# Altium project Printing.PrjPcb (part 4 of 4)

## Sheet Printing5.SchDoc
size A2
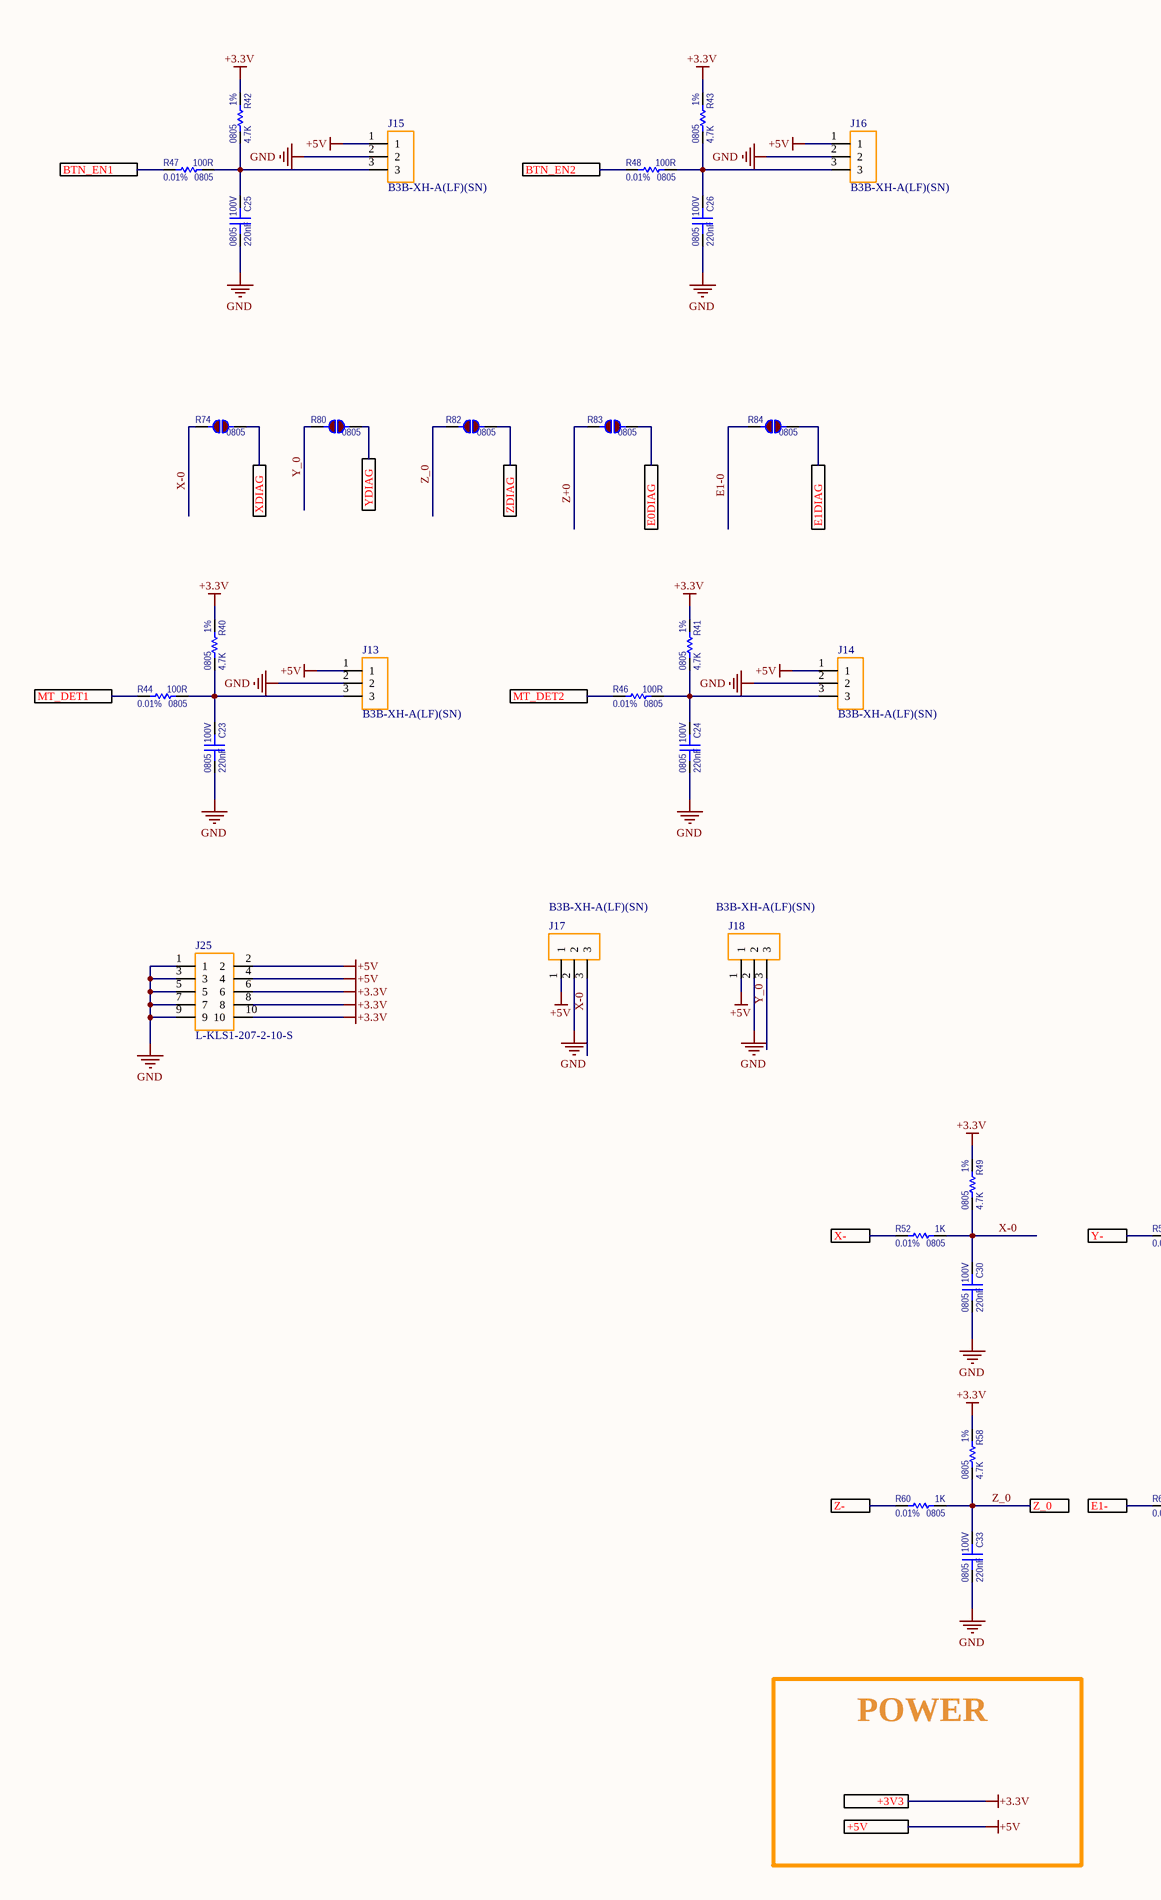
[diagram p7: Printing5.SchDoc, left]
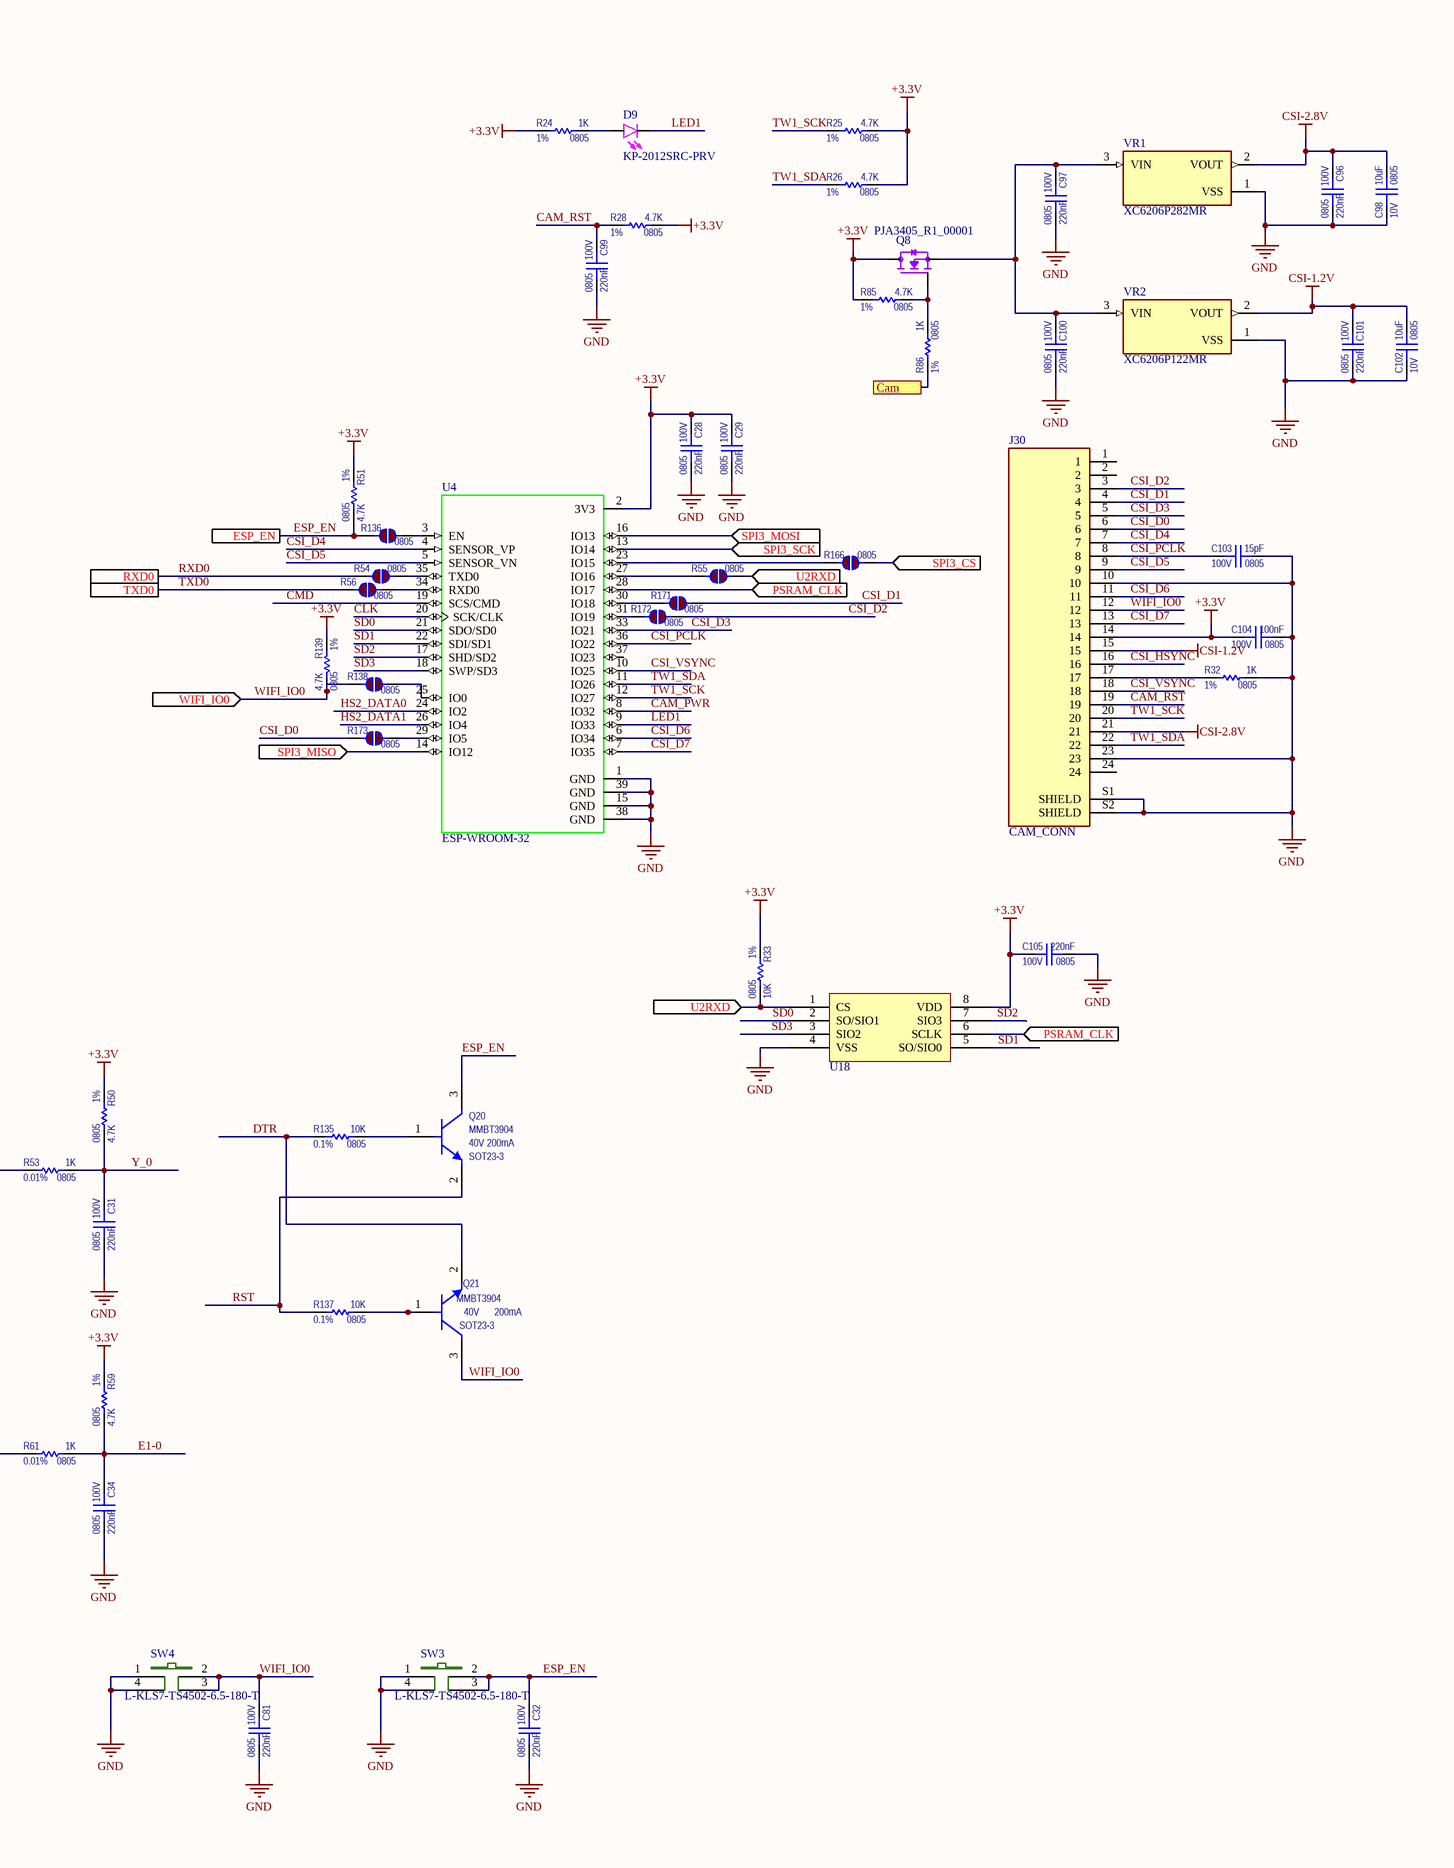
[diagram p8: Printing5.SchDoc, right]

### Parts
C23  value 220nF  Voltage: 100V  Package: 0805  [C_0805_GEN_1.40H]  (hidden comment: Capacitor)
C24  value 220nF  Voltage: 100V  Package: 0805  [C_0805_GEN_1.40H]  (hidden comment: Capacitor)
C25  value 220nF  Voltage: 100V  Package: 0805  [C_0805_GEN_1.40H]  (hidden comment: Capacitor)
C26  value 220nF  Voltage: 100V  Package: 0805  [C_0805_GEN_1.40H]  (hidden comment: Capacitor)
C28  value 220nF  Voltage: 100V  Package: 0805  [C_0805_GEN_1.40H]  (hidden comment: Capacitor)
C29  value 220nF  Voltage: 100V  Package: 0805  [C_0805_GEN_1.40H]  (hidden comment: Capacitor)
C30  value 220nF  Voltage: 100V  Package: 0805  [C_0805_GEN_1.40H]  (hidden comment: Capacitor)
C31  value 220nF  Voltage: 100V  Package: 0805  [C_0805_GEN_1.40H]  (hidden comment: Capacitor)
C32  value 220nF  Voltage: 100V  Package: 0805  [C_0805_GEN_1.40H]  (hidden comment: Capacitor)
C33  value 220nF  Voltage: 100V  Package: 0805  [C_0805_GEN_1.40H]  (hidden comment: Capacitor)
C34  value 220nF  Voltage: 100V  Package: 0805  [C_0805_GEN_1.40H]  (hidden comment: Capacitor)
C81  value 220nF  Voltage: 100V  Package: 0805  [C_0805_GEN_1.40H]  (hidden comment: Capacitor)
C96  value 220nF  Voltage: 100V  Package: 0805  [C_0805_GEN_1.40H]  (hidden comment: Capacitor)
C97  value 220nF  Voltage: 100V  Package: 0805  [C_0805_GEN_1.40H]  (hidden comment: Capacitor)
C98  value 10uF  Voltage: 10V  Package: 0805  [C_0805_GEN_1.40H]  (hidden comment: Capacitor)
C99  value 220nF  Voltage: 100V  Package: 0805  [C_0805_GEN_1.40H]  (hidden comment: Capacitor)
C100  value 220nF  Voltage: 100V  Package: 0805  [C_0805_GEN_1.40H]  (hidden comment: Capacitor)
C101  value 220nF  Voltage: 100V  Package: 0805  [C_0805_GEN_1.40H]  (hidden comment: Capacitor)
C102  value 10uF  Voltage: 10V  Package: 0805  [C_0805_GEN_1.40H]  (hidden comment: Capacitor)
C103  value 15pF  Voltage: 100V  Package: 0805  [C_0805_GEN_1.40H]  (hidden comment: Capacitor)
C104  value 100nF  Voltage: 100V  Package: 0805  [C_0805_GEN_1.40H]  (hidden comment: Capacitor)
C105  value 220nF  Voltage: 100V  Package: 0805  [C_0805_GEN_1.40H]  (hidden comment: Capacitor)
D9  KP-2012SRC-PRV  [0805 LED]
J13  B3B-XH-A(LF)(SN)  [JST_B3B-XH-A(LF)(SN)]
J14  B3B-XH-A(LF)(SN)  [JST_B3B-XH-A(LF)(SN)]
J15  B3B-XH-A(LF)(SN)  [JST_B3B-XH-A(LF)(SN)]
J16  B3B-XH-A(LF)(SN)  [JST_B3B-XH-A(LF)(SN)]
J17  B3B-XH-A(LF)(SN)  [JST_B3B-XH-A(LF)(SN)]
J18  B3B-XH-A(LF)(SN)  [JST_B3B-XH-A(LF)(SN)]
J25  L-KLS1-207-2-10-S  [L-KLS1-207-2-10-S]
J30  CAM_CONN  [CAM_CONN]
Q8  PJA3405_R1_00001  [PJA3405_R1_00001]
Q20  value MMBT3904  Current: 200mA  Voltage: 40V  Package: SOT23-3  [SOT23-3_MMBT3904,215]  (hidden comment: SingleNPN_B1E2C3)
Q21  value MMBT3904  Current: 200mA  Voltage: 40V  Package: SOT23-3  [SOT23-3_MMBT3904,215]  (hidden comment: SingleNPN_B1E2C3)
R24  value 1K  Tolerance: 1%  Package: 0805  [R_0805_GEN_0.60H]  (hidden comment: StandardResistor)
R25  value 4.7K  Tolerance: 1%  Package: 0805  [R_0805_GEN_0.60H]  (hidden comment: StandardResistor)
R26  value 4.7K  Tolerance: 1%  Package: 0805  [R_0805_GEN_0.60H]  (hidden comment: StandardResistor)
R28  value 4.7K  Tolerance: 1%  Package: 0805  [R_0805_GEN_0.60H]  (hidden comment: StandardResistor)
R32  value 1K  Tolerance: 1%  Package: 0805  [R_0805_GEN_0.60H]  (hidden comment: StandardResistor)
R33  value 10K  Tolerance: 1%  Package: 0805  [R_0805_GEN_0.60H]  (hidden comment: StandardResistor)
R40  value 4.7K  Tolerance: 1%  Package: 0805  [R_0805_GEN_0.60H]  (hidden comment: StandardResistor)
R41  value 4.7K  Tolerance: 1%  Package: 0805  [R_0805_GEN_0.60H]  (hidden comment: StandardResistor)
R42  value 4.7K  Tolerance: 1%  Package: 0805  [R_0805_GEN_0.60H]  (hidden comment: StandardResistor)
R43  value 4.7K  Tolerance: 1%  Package: 0805  [R_0805_GEN_0.60H]  (hidden comment: StandardResistor)
R44  value 100R  Tolerance: 0.01%  Package: 0805  [R_0805_GEN_0.70H]  (hidden comment: StandardResistor)
R46  value 100R  Tolerance: 0.01%  Package: 0805  [R_0805_GEN_0.70H]  (hidden comment: StandardResistor)
R47  value 100R  Tolerance: 0.01%  Package: 0805  [R_0805_GEN_0.70H]  (hidden comment: StandardResistor)
R48  value 100R  Tolerance: 0.01%  Package: 0805  [R_0805_GEN_0.70H]  (hidden comment: StandardResistor)
R49  value 4.7K  Tolerance: 1%  Package: 0805  [R_0805_GEN_0.60H]  (hidden comment: StandardResistor)
R50  value 4.7K  Tolerance: 1%  Package: 0805  [R_0805_GEN_0.60H]  (hidden comment: StandardResistor)
R51  value 4.7K  Tolerance: 1%  Package: 0805  [R_0805_GEN_0.60H]  (hidden comment: StandardResistor)
R52  value 1K  Tolerance: 0.01%  Package: 0805  [R_0805_GEN_0.70H]  (hidden comment: StandardResistor)
R53  value 1K  Tolerance: 0.01%  Package: 0805  [R_0805_GEN_0.70H]  (hidden comment: StandardResistor)
R54  Package: 0805  [R_0805_GEN_0.70H]  (hidden comment: StandardJumper)
R55  Package: 0805  [R_0805_GEN_0.70H]  (hidden comment: StandardJumper)
R56  Package: 0805  [R_0805_GEN_0.70H]  (hidden comment: StandardJumper)
R58  value 4.7K  Tolerance: 1%  Package: 0805  [R_0805_GEN_0.60H]  (hidden comment: StandardResistor)
R59  value 4.7K  Tolerance: 1%  Package: 0805  [R_0805_GEN_0.60H]  (hidden comment: StandardResistor)
R60  value 1K  Tolerance: 0.01%  Package: 0805  [R_0805_GEN_0.70H]  (hidden comment: StandardResistor)
R61  value 1K  Tolerance: 0.01%  Package: 0805  [R_0805_GEN_0.70H]  (hidden comment: StandardResistor)
R74  Package: 0805  [R_0805_GEN_0.70H]  (hidden comment: StandardJumper)
R80  Package: 0805  [R_0805_GEN_0.70H]  (hidden comment: StandardJumper)
R82  Package: 0805  [R_0805_GEN_0.70H]  (hidden comment: StandardJumper)
R83  Package: 0805  [R_0805_GEN_0.70H]  (hidden comment: StandardJumper)
R84  Package: 0805  [R_0805_GEN_0.70H]  (hidden comment: StandardJumper)
R85  value 4.7K  Tolerance: 1%  Package: 0805  [R_0805_GEN_0.60H]  (hidden comment: StandardResistor)
R86  value 1K  Tolerance: 1%  Package: 0805  [R_0805_GEN_0.60H]  (hidden comment: StandardResistor)
R135  value 10K  Tolerance: 0.1%  Package: 0805  [R_0805_GEN_0.70H]  (hidden comment: StandardResistor)
R136  Package: 0805  [R_0805_GEN_0.70H]  (hidden comment: StandardJumper)
R137  value 10K  Tolerance: 0.1%  Package: 0805  [R_0805_GEN_0.70H]  (hidden comment: StandardResistor)
R138  Package: 0805  [R_0805_GEN_0.70H]  (hidden comment: StandardJumper)
R139  value 4.7K  Tolerance: 1%  Package: 0805  [R_0805_GEN_0.60H]  (hidden comment: StandardResistor)
R166  Package: 0805  [R_0805_GEN_0.70H]  (hidden comment: StandardJumper)
R171  Package: 0805  [R_0805_GEN_0.70H]  (hidden comment: StandardJumper)
R172  Package: 0805  [R_0805_GEN_0.70H]  (hidden comment: StandardJumper)
R173  Package: 0805  [R_0805_GEN_0.70H]  (hidden comment: StandardJumper)
SW3  L-KLS7-TS4502-6.5-180-T  [L-KLS7-TS4502-6.5-180-T]
SW4  L-KLS7-TS4502-6.5-180-T  [L-KLS7-TS4502-6.5-180-T]
U4  ESP-WROOM-32  [ESP_DUAL]
U18  PSRAM_ESP32  [SOP8]  (value not drawn)
VR1  XC6206P282MR  [SOT95P280X130-3N]
VR2  XC6206P122MR  [SOT95P280X130-3N]

### Ports
+3V3, +5V, BTN_EN1, BTN_EN2, Cam, E0DIAG, E1-, E1DIAG, ESP_EN, MT_DET1, MT_DET2, PSRAM_CLK (in), RXD0, SPI3_CS (in), SPI3_MISO (in), SPI3_MOSI (in), SPI3_SCK (in), TXD0, U2RXD (in), WIFI_IO0 (in), X-, XDIAG, Y-, YDIAG, Z-, Z_0, ZDIAG

### Nets
+3.3V: C28.1 C29.1 C104.1 C105.1 J25.6 J25.8 J25.10 J30.14 Q8.3(D) R24.1 R25.2 R26.2 R28.2 R33.1 R40.1 R41.1 R42.1 R43.1 R49.1 R50.1 R51.1 R58.1 R59.1 R85.1 R139.1 U4.2(3V3) U18.8(VDD) ; port +3V3  [project net +3V3]
+5V: J13.1 J14.1 J15.1 J16.1 J17.1 J18.1 J25.2 J25.4 ; port +5V
CSI-1.2V: C101.1 C102.2 J30.15 VR2.2(VOUT)
CSI-2.8V: C96.1 C98.2 J30.21 VR1.2(VOUT)
GND: C23.2 C24.2 C25.2 C26.2 C28.2 C29.2 C30.2 C31.2 C32.2 C33.2 C34.2 C81.2 C96.2 C97.2 C98.1 C99.2 C100.2 C101.2 C102.1 C103.2 C104.2 C105.2 J13.2 J14.2 J15.2 J16.2 J17.2 J18.2 J25.1 J25.3 J25.5 J25.7 J25.9 J30.10 J30.23 J30.S1(SHIELD) J30.S2(SHIELD) R32.2 SW3.1(A0) SW3.4(A1) SW4.1(A0) SW4.4(A1) U4.1(GND) U4.15(GND) U4.38(GND) U4.39(GND) U18.4(VSS) VR1.1(VSS) VR2.1(VSS)
BTN_EN1: R47.1 ; port BTN_EN1
BTN_EN2: R48.1 ; port BTN_EN2
CAM: R86.1 ; port Cam
CAM_PWR: U4.8(IO32)
CAM_RST: C99.1 J30.19 R28.1
CLK: U4.20(SCK/CLK)
CMD: U4.19(SCS/CMD)
CSI_D0: J30.6 R173.1
CSI_D1: J30.4 R171.2
CSI_D2: J30.3 R172.2
CSI_D3: J30.5 U4.33(IO21)
CSI_D4: J30.7 U4.4(SENSOR_VP)
CSI_D5: J30.9 U4.5(SENSOR_VN)
CSI_D6: J30.11 U4.6(IO34)
CSI_D7: J30.13 U4.7(IO35)
CSI_HSYNC: J30.16
CSI_PCLK: C103.1 J30.8 U4.36(IO22)
CSI_VSYNC: J30.18 U4.10(IO25)
DTR: Q21.2(EMITTER) R135.1
E0DIAG: R83.2 ; port E0DIAG
E1-: R61.1 ; port E1-
E1-0: C34.1 R59.2 R61.2 R84.1
E1DIAG: R84.2 ; port E1DIAG
ESP_EN: C32.1 Q20.3(COLLECTOR) R51.2 R136.1 SW3.2(B0) SW3.3(B1) ; port ESP_EN
HS2_DATA0: U4.24(IO2)
HS2_DATA1: U4.26(IO4)
LED1: D9.K(C) U4.9(IO33)
MT_DET1: R44.1 ; port MT_DET1
MT_DET2: R46.1 ; port MT_DET2
PSRAM_CLK: U4.28(IO17) U18.6(SCLK) ; port PSRAM_CLK
RST: Q20.2(EMITTER) R137.1
RXD0: R54.1 ; port RXD0
SD0: U4.21(SDO/SD0) U18.2(SO/SIO1)
SD1: U4.22(SDI/SD1) U18.5(SO/SIO0)
SD2: U4.17(SHD/SD2) U18.7(SIO3)
SD3: U4.18(SWP/SD3) U18.3(SIO2)
SPI3_CS: R166.2 ; port SPI3_CS
SPI3_MISO: U4.14(IO12) ; port SPI3_MISO
SPI3_MOSI: U4.16(IO13) ; port SPI3_MOSI
SPI3_SCK: U4.13(IO14) ; port SPI3_SCK
TW1_SCK: J30.20 R25.1 U4.12(IO27)
TW1_SDA: J30.22 R26.1 U4.11(IO26)
TXD0: R56.1 ; port TXD0
U2RXD: R33.2 R55.2 U18.1(CS) ; port U2RXD
WIFI_IO0: C81.1 J30.12 Q21.3(COLLECTOR) R138.1 R139.2 SW4.2(B0) SW4.3(B1) ; port WIFI_IO0
X-: R52.1 ; port X-
X-0: C30.1 J17.3 R49.2 R52.2 R74.1
XDIAG: R74.2 ; port XDIAG
Y-: R53.1 ; port Y-
Y_0: C31.1 J18.3 R50.2 R53.2 R80.1
YDIAG: R80.2 ; port YDIAG
Z+0: R83.1
Z-: R60.1 ; port Z-
Z_0: C33.1 R58.2 R60.2 R82.1 ; port Z_0
ZDIAG: R82.2 ; port ZDIAG
NetC23_1: C23.1 J13.3 R40.2 R44.2
NetC24_1: C24.1 J14.3 R41.2 R46.2
NetC25_1: C25.1 J15.3 R42.2 R47.2
NetC26_1: C26.1 J16.3 R43.2 R48.2
NetC97_1: C97.1 C100.1 Q8.2(S) VR1.3(VIN) VR2.3(VIN)
NetD9_A: D9.A R24.2
NetJ30_17: J30.17 R32.1
NetQ8_1: Q8.1(G) R85.2 R86.2
NetQ20_1: Q20.1(BASE) R135.2
NetQ21_1: Q21.1(BASE) R137.2
NetR54_2: R54.2 U4.35(TXD0)
NetR55_1: R55.1 U4.27(IO16)
NetR56_2: R56.2 U4.34(RXD0)
NetR136_2: R136.2 U4.3(EN)
NetR138_2: R138.2 U4.25(IO0)
NetR166_1: R166.1 U4.23(IO15)
NetR171_1: R171.1 U4.30(IO18)
NetR172_1: R172.1 U4.31(IO19)
NetR173_2: R173.2 U4.29(IO5)

Not connected (* = marked no-connect by the designer): J30 1 2 24; U4 37(IO23)

### Notes on the sheet
- POWER
- Title
- Size:
- Date:
- File:
- A2
- Number:
- Time:
- Revision:
- Sheet
- of

### Library data of the parts
C23-C26 C28-C34 C81 C96 C97 C99-C101 C103-C105 = CER_220nF_#9: CAP_CER_220nF_100V_X7R_10%_0805; Manufacturer#1: Kemet; Manufacturer#1 PN: C0805C224K1RECAUTO; Manufacturer#2 PN: HMJ212BB7224KGHT; Similar Part: CC0805KKX7R0BB224; GRM21AR72A224KAC5L; Added by: YasinY; FireANTs Code: C00131; Grade Level: Automotive; Lead Status: Pb-Free; Location: 3G8; Max Reflow Duration: 30; Max Reflow Temp: 260; Placement Area: 10.45; Power Rating: X; Temp# Operating: -55°C/+125°C; Tolerance: 10%; Identifier: CER_220nF_#9; Checked by: İlkerU; ComponentLink1Description: Resource Folder; ComponentLink1URL: C:\FireANTs_Repo\HW_Lib\trunk\ComponentLibrary\Resources\Capacitors\C00131; Cost: 0.30; Current: N/A; Failure in Time: N/A; Features: AEC-Q200; Height: 1.40; Manufacturer#2: Taiyo Yuden; MSL: 1; Mounting Type: SMD; Part Status: Active; Temp# Storage: N/A; Weight: 19mg
C98 C102 = CER_10uF_#13: CAP_CER_10uF_10V_X7S_10%_0805; Manufacturer#1: TDK; Manufacturer#1 PN: CGA4J3X7S1A106K125AE; Manufacturer#2 PN: GCM21BR71A106KE22K; Similar Part: C0805C106K8RACAUTO; Added by: HasanA; FireANTs Code: C00165; Grade Level: Automotive; Lead Status: Pb-Free; Location: 3E17; Max Reflow Duration: 10; Max Reflow Temp: 260; Placement Area: 10.45; Power Rating: X; Temp# Operating: -55°C/+125°C; Tolerance: 10%; Identifier: CER_10uF_#13; Checked by: İlkerU; ComponentLink1Description: Resource Folder; ComponentLink1URL: C:\FireANTs_Repo\HW_Lib\trunk\ComponentLibrary\Resources\Capacitors\C00165; Cost: 0.54; Current: N/A; Failure in Time: N/A; Features: AEC-Q200; Height: 1.40; Manufacturer#2: Murata; MSL: 1; Mounting Type: SMD; Part Status: Active; Temp# Storage: N/A; Weight: 19mg
D9 = KP-2012SRC-PRV: KP-2012SRC-PRV Red LED, 640 nm 2012 (0805), Rectangle Lens SMD package; Manufacturer: Kingbright; Lens Color: Clear; Viewing Angle: 120°; Lens Style: Rectangular,Diffused,Colorless; Number of LEDs: 1; Wavelength: 640nm; Luminous Intensity: 100mcd; Forward Voltage: 1.85V; Forward Current: 20mA; Supplier 1: Farnell; Manufacturer Part Number: KP-2012SRC-PRV; RoHS: Yes; Category: LEDs; Pricing 1: 5=0,12900, 50=0,10200, 100=0,09830, 500=0,08370, 1000=0,07290 (EUR); Mount: Surface Mount; Case/Package: 2012; Number of Pins: 2; Color: Red; Min Operating Temperature: -40°C; Max Operating Temperature: 85°C; Packaging: Cut Tape; Dominant Wavelength: 640nm; Radiation Hardening: No; Reach SVHC Compliant: Yes; RoHS Compliant: Yes; ComponentLink1URL: https://datasheet.ciiva.com/14176/kp2012src-prv-eng-tds-14176962.pdf?src-supplier=Distrelec; ComponentLink1Description: https://datasheet.ciiva.com/14176/kp2012src-prv-eng-tds-14176962.pdf?src-supplier=Distrelec; ComponentLink2URL: https://datasheet.ciiva.com/11773/0900766b8032fa8d-11773524.pdf?src-supplier=RSComponents; ComponentLink2Description: https://datasheet.ciiva.com/11773/0900766b8032fa8d-11773524.pdf?src-supplier=RSComponents; ComponentLink3URL: https://datasheet.ciiva.com/14634/0900766b8032fa8d-14634746.pdf?src-supplier=Allied+Electronics; ComponentLink3Description: https://datasheet.ciiva.com/14634/0900766b8032fa8d-14634746.pdf?src-supplier=Allied+Electronics; ComponentLink4URL: https://datasheet.ciiva.com/29281/180105-da-01-en-led-0805-typ-kp-2012src-prv-29281248.pdf?src-supplier=Conrad; ComponentLink4Description: https://datasheet.ciiva.com/29281/180105-da-01-en-led-0805-typ-kp-2012src-prv-29281248.pdf?src-supplier=Conrad; Supplier Part Number 1: 1318244
Q8 = PJA3405_R1_00001: Power Field-Effect Transistor, 3.6A I(D), 30V, 0.073ohm, 1-Element, P-Channel, Silicon, Metal-oxide Semiconductor FET; Manufacturer: Pan Jit; Supplier 1: Digi-Key; Manufacturer Part Number: PJA3405_R1_00001; RoHS: Yes; Stock 1: 17264; Pricing 1: 1=0,44000, 10=0,33400, 100=0,20830, 500=0,14250, 1000=0,10962 (USD); Supplier Part Number 1: 3757-PJA3405_R1_00001CT-ND
Q20 Q21 = NPN_40V-200mA_#1: TRA_NPN_SING_40V_200mA_VSAT300mV_SOT23-3; Manufacturer#1: Nexperia; Manufacturer#1 PN: MMBT3904,215; Manufacturer#2 PN: MMBT3904-7-F; Similar Part: SST3904HZGT116; PMBT3904,235; Added by: HasanA; FireANTs Code: Q00012; Failure in Time: 0.44@[60%CL; 55°C; 0.7eV]; Grade Level: Industrial; Lead Status: Pb-Free; Location: 4D3; Max Reflow Duration: 30; Max Reflow Temp: 260; Placement Area: 14.00; Power Rating: X; Temp# Operating: -65°C/+150°C; Identifier: NPN_40V-200mA_#1; Checked by: EserC; ComponentLink1Description: Resource Folder; ComponentLink1URL: C:\BNA_Repo\HW_Lib\trunk\ComponentLibrary\Resources\Transistors\Q00012; Cost: 0.10; Features: Single NPN signal BJT; Height: 1.10; Manufacturer#2: Diodes; MSL: 1; Mounting Type: SMD; Part Status: Active; Temp# Storage: -65°C/+150°C; Tolerance: X; Weight: 7.48mg
R24-R26 R28 R32 R33 R40-R43 R49-R51 R58 R59 R85 R86 R139 = STD_4.7K_#3: RES_STD_4.7K_0.125W_1%_100ppm_0805; Manufacturer#1: Yageo; Manufacturer#1 PN: AC0805FR-074K7L; Manufacturer#2 PN: ERJ-6ENF4701V; Added by: SonerI; FireANTs Code: R00230; Current: X; Grade Level: Automotive; Lead Status: Pb-Free; Location: TBD; Max Reflow Duration: 10; Max Reflow Temp: 260; Placement Area: 10.45; Power Rating: 125mW; Temp# Operating: -55°C/+155°C; Voltage: 150V; Identifier: STD_4.7K_#3; Checked by: YasinY; ComponentLink1Description: Resource Folder; ComponentLink1URL: C:\FireANTs_Repo\HW_Lib\trunk\ComponentLibrary\Resources\Resistors\R00230; Cost: 0.10; Failure in Time: N/A; Features: AEC-Q200; Height: 0.60; Manufacturer#2: Panasonic; MSL: 1; Mounting Type: SMD; Part Status: Active; Similar Part: N/A; Temp# Storage: N/A; Weight: 5.5mg
R44 R46-R48 = STD_100R_#7: RES_STD_100R_0.125W_0.01%_5ppm_0805; Manufacturer#1: Stackpole; Manufacturer#1 PN: RNCF0805TKY100R; Manufacturer#2 PN: RNCF0805TTY100R; Added by: HasanA; FireANTs Code: R00071; Current: X; Grade Level: Automotive; Lead Status: Pb-Free; Location: 2C18; Max Reflow Duration: 10; Max Reflow Temp: 260; Placement Area: 10.45; Power Rating: 125mW; Temp# Operating: -55°C/+155°C; Voltage: 150V; Identifier: STD_100R_#7; Checked by: YasinY; ComponentLink1Description: Resource Folder; ComponentLink1URL: C:\FireANTs_Repo\HW_Lib\trunk\ComponentLibrary\Resources\Resistors\R00071; Cost: 2.15; Failure in Time: N/A; Features: AEC-Q200; Height: 0.70; Manufacturer#2: Stackpole; MSL: 1; Mounting Type: SMD; Part Status: Active; Similar Part: N/A; Temp# Storage: N/A; Weight: 5.5mg
R52 R53 R60 R61 = STD_1K_#4: RES_STD_1K_0.125W_0.01%_5ppm_0805; Manufacturer#1: Stackpole; Manufacturer#1 PN: RNCF0805TKY1K00; Manufacturer#2 PN: PLT0805Z1001LBTS; Similar Part: PLTU0805U1001LST5; Added by: HasanA; FireANTs Code: R00068; Current: X; Grade Level: Automotive; Lead Status: Pb-Free; Location: 2D17; Max Reflow Duration: 10; Max Reflow Temp: 260; Placement Area: 10.45; Power Rating: 125mW; Temp# Operating: -55°C/+155°C; Voltage: 150V; Identifier: STD_1K_#4; Checked by: YasinY; ComponentLink1Description: Resource Folder; ComponentLink1URL: C:\FireANTs_Repo\HW_Lib\trunk\ComponentLibrary\Resources\Resistors\R00068; Cost: 2.15; Failure in Time: N/A; Features: AEC-Q200; Height: 0.70; Manufacturer#2: Vishay; MSL: 1; Mounting Type: SMD; Part Status: Active; Temp# Storage: N/A; Weight: 5.5mg
R54-R56 R74 R80 R82-R84 R136 R138 R166 R171-R173 = STD_JUMPER_#3: RES_STD_0R_0.125W_0805; Manufacturer#1: Yageo; Manufacturer#1 PN: AC0805JR-070RL; Manufacturer#2 PN: ERJ-6GEY0R00V; Value: 0R; Added by: İlhanT; FireANTs Code: R00008; Current: X; Grade Level: Automotive; Lead Status: Pb-Free; Location: 2D2; Max Reflow Duration: 10; Max Reflow Temp: 260; Placement Area: 10.45; Power Rating: 125mW; Temp# Operating: -55°C/+155°C; Tolerance: 5%; Voltage: 150V; Identifier: STD_JUMPER_#3; Checked by: YasinY; ComponentLink1Description: Resource Folder; ComponentLink1URL: C:\FireANTs_Repo\HW_Lib\trunk\ComponentLibrary\Resources\Resistors\R00008; Cost: 0.10; Failure in Time: N/A; Features: AEC-Q200; Height: 0.70; Manufacturer#2: Panasonic; MSL: 1; Mounting Type: SMD; Part Status: Active; Similar Part: N/A; Temp# Storage: N/A; Weight: 5.5mg
R135 R137 = STD_10K_#6: RES_STD_10K_0.125W_0.1%_25ppm_0805; Manufacturer#1: Panasonic; Manufacturer#1 PN: ERA-6AEB103V; Manufacturer#2 PN: RG2012P-103-B-T5; Similar Part: RN73C2A10KBTD; Added by: İlhanT; FireANTs Code: R00091; Current: X; Grade Level: Automotive; Lead Status: Pb-Free; Location: 2C23; Max Reflow Duration: 10; Max Reflow Temp: 260; Placement Area: 10.45; Power Rating: 125mW; Temp# Operating: -55°C/+155°C; Voltage: 100V; Identifier: STD_10K_#6; Checked by: YasinY; ComponentLink1Description: Resource Folder; ComponentLink1URL: C:\FireANTs_Repo\HW_Lib\trunk\ComponentLibrary\Resources\Resistors\R00091; Cost: 0.31; Failure in Time: N/A; Features: AEC-Q200; Height: 0.70; Manufacturer#2: Susumu; MSL: 1; Mounting Type: SMD; Part Status: Active; Temp# Storage: N/A; Weight: 5.5mg
VR1 VR2 = XC6206P302MR: Linear Voltage Regulator IC 1 Output 200mA SOT-23; Package: None; Price: None; Value: *; MP: XC6206P302MR; Availability: Unavailable
J13-J18 = B3B-XH-A(LF)(SN): Value: *; MP: B3B-XH-A(LF)(SN); Availability: Unavailable; Package: None; Price: None

## Nets that join several sheets
+3V3: Printing2 (5 pins), Printing3 (15 pins), Printing4 (R73.2 R75.2), Printing (40 pins), Printing5 (27 pins)
+5V: Printing2 (R155.1), Printing4 (6 pins), Printing6 (R187.1 R188.1), Printing (14 pins), Printing5 (8 pins)
+12V: Printing6 (C95.1 U17.6), Printing (C82.2 C83.2 U15.2)
+24VA: Printing2 (18 pins), Printing3 (25 pins), Printing4 (17 pins), Printing6 (J11.1 J55.1), Printing (11 pins)
GND: Printing2 (44 pins), Printing3 (55 pins), Printing4 (26 pins), Printing6 (14 pins), Printing (96 pins), Printing5 (49 pins)
12V_MOTOR: Printing6 (R23.1), Printing (IC2.64)
BTN_EN1: Printing (IC2.33), Printing5 (R47.1)
BTN_EN2: Printing (IC2.34), Printing5 (R48.1)
CAM: Printing (IC2.18), Printing5 (R86.1)
E0_DIR: Printing3 (R153.1), Printing (IC2.84)
E0_EN: Printing3 (R149.1), Printing (IC2.89)
E0_STEP: Printing3 (R151.1), Printing (IC2.87)
E0_UART: Printing3 (R103.1 U8.14), Printing (IC2.56)
E0DIAG: Printing3 (U8.11), Printing5 (R83.2)
E1-: Printing (IC2.38), Printing5 (R61.1)
E1_DIR: Printing3 (R148.1), Printing (IC2.24)
E1_EN: Printing3 (R146.1), Printing (IC2.26)
E1_STEP: Printing3 (R147.1), Printing (IC2.62)
E1_UART: Printing3 (R110.1 U9.14), Printing (IC2.55)
E1DIAG: Printing3 (U9.11), Printing5 (R84.2)
ESP_EN: Printing (IC2.40), Printing5 (6 pins)
HEATER: Printing6 (R22.1), Printing (IC2.4)
HOTBED: Printing6 (R165.2 R189.1), Printing (IC2.23)
HOTEND: Printing6 (J55.2 Q25.TAB), Printing (J20.11 J20.12 J20.13 J20.14)
IN22: Printing2 (R127.2 U1.15), Printing (IC2.52)
MOS_1: Printing4 (R62.1 R66.1), Printing (IC2.63)
MOS_2: Printing4 (R63.1 R67.1), Printing (IC2.58)
MOS_3: Printing4 (R64.1 R68.1), Printing (IC2.57)
MOS_4: Printing4 (R133.1 R134.1), Printing (IC2.46)
MOS_5: Printing4 (R71.1 R78.1), Printing (IC2.44)
MOS_6: Printing4 (R72.1 R79.1), Printing (IC2.43)
MOS_7: Printing4 (R70.1 R77.1), Printing (IC2.41)
MOS_8: Printing4 (R159.1 R160.1), Printing (IC2.39)
MOS_9: Printing4 (R161.1 R162.1), Printing (IC2.60)
MT_DET1: Printing (IC2.29), Printing5 (R44.1)
MT_DET2: Printing (IC2.5), Printing5 (R46.1)
PA5: Printing2 (R180.2 U1.6), Printing (IC2.30)
PA6: Printing2 (R124.2 U1.11), Printing (IC2.31)
PA8: Printing2 (R178.2 U1.2), Printing (IC2.67)
RXD0: Printing (IC2.69 J6.3), Printing5 (R54.1)
SPI3_CS: Printing (R117.1 R174.2 R175.1 R186.1), Printing5 (R166.2)
SPI3_MISO: Printing (IC2.79 J47.7 R114.1), Printing5 (U4.14)
SPI3_MOSI: Printing (IC2.80 J47.3 R116.1), Printing5 (U4.16)
SPI3_SCK: Printing (IC2.78 J47.5 R115.1), Printing5 (U4.13)
SSR_2: Printing6 (R163.2 R176.1), Printing (IC2.45)
TB: Printing4 (R76.1), Printing (IC2.15)
TH2: Printing4 (R81.1), Printing (IC2.25)
TXD0: Printing (IC2.68 J6.4), Printing5 (R56.1)
WIFI_IO0: Printing (IC2.7), Printing5 (7 pins)
X-: Printing (IC2.77), Printing5 (R52.1)
X_DIR: Printing3 (R145.1), Printing (IC2.1)
X_EN: Printing3 (R141.1), Printing (IC2.3)
X_STEP: Printing3 (R143.1), Printing (IC2.2)
X_UART: Printing3 (R92.1 U5.14), Printing (IC2.86)
XDIAG: Printing3 (U5.11), Printing5 (R74.2)
Y-: Printing (IC2.83), Printing5 (R53.1)
Y_DIR: Printing3 (R144.1), Printing (IC2.96)
Y_EN: Printing3 (R140.1), Printing (IC2.98)
Y_STEP: Printing3 (R142.1), Printing (IC2.97)
Y_UART: Printing3 (R93.1 U6.14), Printing (IC2.88)
YDIAG: Printing3 (U6.11), Printing5 (R80.2)
Z-: Printing (IC2.65), Printing5 (R60.1)
Z_0: Printing (J20.9), Printing5 (C33.1 R58.2 R60.2 R82.1)
Z_DIR: Printing3 (R154.1), Printing (IC2.90)
Z_EN: Printing3 (R150.1), Printing (IC2.95)
Z_STEP: Printing3 (R152.1), Printing (IC2.91)
Z_UART: Printing3 (R102.1 U7.14), Printing (IC2.85)
ZDIAG: Printing3 (U7.11), Printing5 (R82.2)